# Altium schematic sheet MCU_watch.SchDoc: MCU_Watch
size A4; Author: Sajitha Madugalle; Revision: 1; SheetNumber: 5; SheetTotal: 8
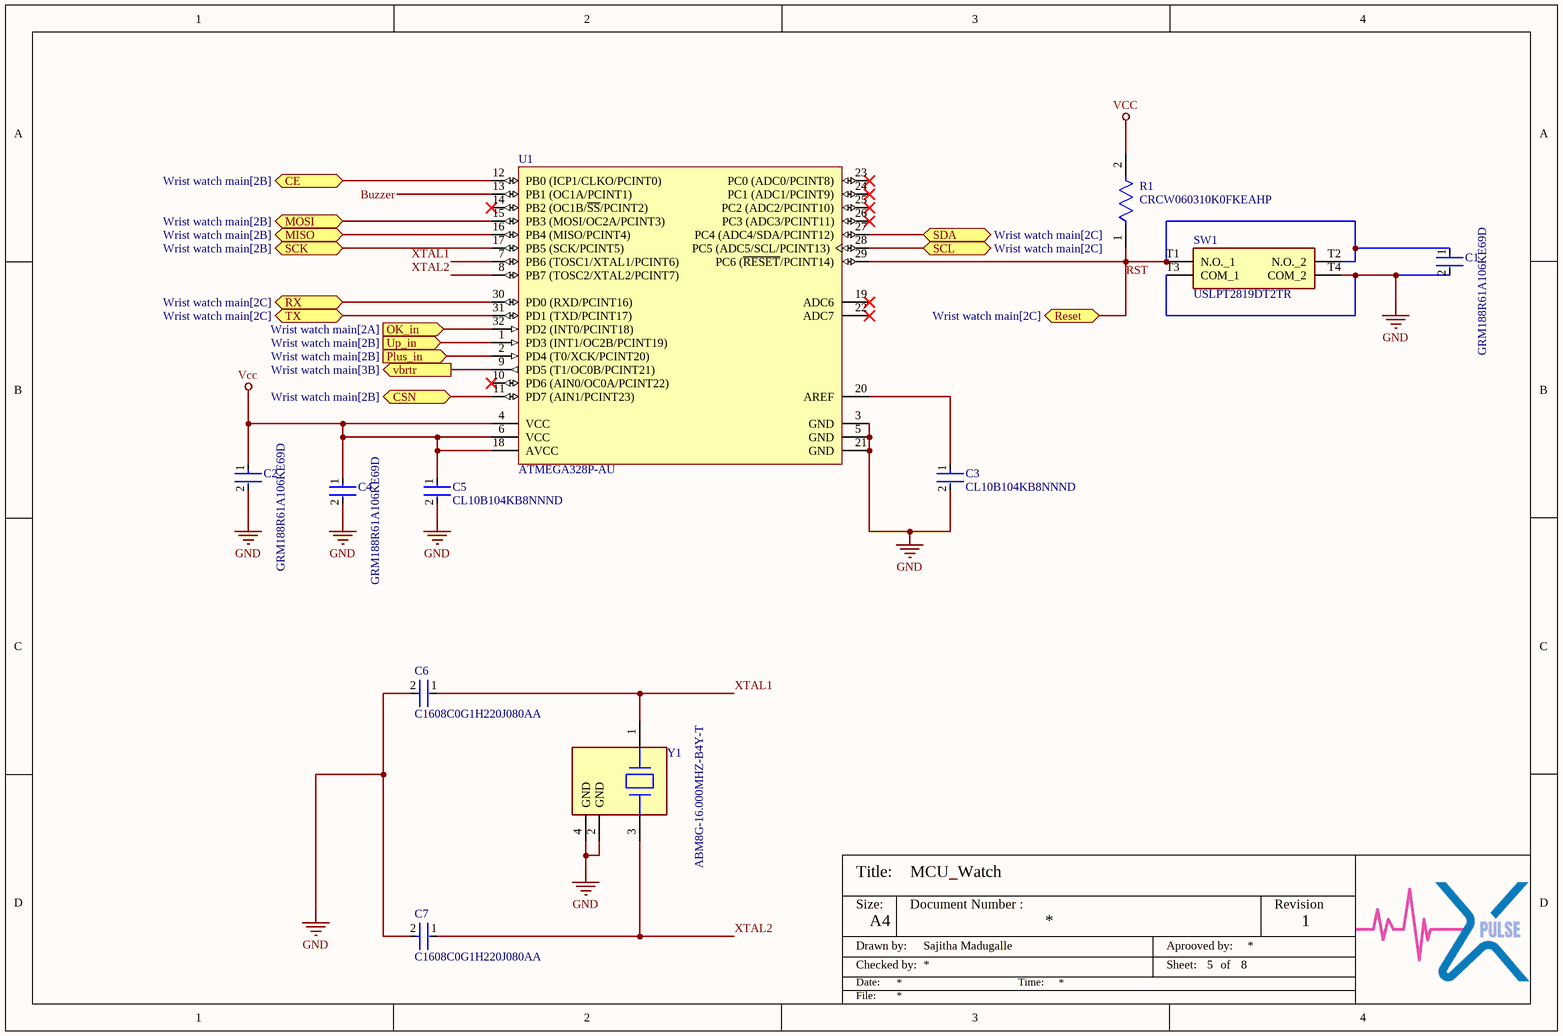
[diagram p0: MCU_watch.SchDoc]

## Parts
C1  GRM188R61A106KE69D  [FP-GRM18-0_15-MFG]
C2  GRM188R61A106KE69D  [FP-GRM18-0_15-MFG]
C3  CL10B104KB8NNND  [FP-CL10-IPC_A]
C4  GRM188R61A106KE69D  [FP-GRM18-0_15-MFG]
C5  CL10B104KB8NNND  [FP-CL10-IPC_A]
C6  C1608C0G1H220J080AA  [FP-C1608-080-0_1-IPC_B]
C7  C1608C0G1H220J080AA  [FP-C1608-080-0_1-IPC_B]
R1  CRCW060310K0FKEAHP  [FP-CRCW0603-HPe3-MFG]
SW1  USLPT2819DT2TR  [USLPT2819DT2TR]
U1  ATMEGA328P-AU  [ATML-32A_M]
Y1  ABM8G-16.000MHZ-B4Y-T  [FP-ABM8G-MFG]

## Ports
CE (bidir, see Wrist watch main[2B]), CSN (bidir, see Wrist watch main[2B]), MISO (bidir, see Wrist watch main[2B]), MOSI (bidir, see Wrist watch main[2B]), OK_in (in, see Wrist watch main[2A]), Plus_in (in, see Wrist watch main[2B]), Reset (bidir, see Wrist watch main[2C]), RX (bidir, see Wrist watch main[2C]), SCK (bidir, see Wrist watch main[2B]), SCL (bidir, see Wrist watch main[2C]), SDA (bidir, see Wrist watch main[2C]), TX (bidir, see Wrist watch main[2C]), Up_in (in, see Wrist watch main[2B]), vbrtr (out, see Wrist watch main[3B])

## Nets
GND: C1.2 C2.2 C3.2 C4.2 C5.2 C6.2 C7.2 SW1.T3(COM_1) SW1.T4(COM_2) U1.3(GND) U1.5(GND) U1.21(GND) Y1.2(GND) Y1.4(GND)
Vcc: C2.1 C4.1 C5.1 R1.2 U1.4(VCC) U1.6(VCC) U1.18(AVCC)
Buzzer: U1.13(PB1_(OC1A/PCINT1))
CE: U1.12(PB0_(ICP1/CLKO/PCINT0)) ; port CE
CSN: U1.11(PD7_(AIN1/PCINT23)) ; port CSN
MISO: U1.16(PB4_(MISO/PCINT4)) ; port MISO
MOSI: U1.15(PB3_(MOSI/OC2A/PCINT3)) ; port MOSI
OK_in: U1.32(PD2_(INT0/PCINT18)) ; port OK_in
Plus_in: U1.2(PD4_(T0/XCK/PCINT20)) ; port Plus_in
RST: C1.1 R1.1 SW1.T1(N.O._1) SW1.T2(N.O._2) U1.29(PC6_(~{RESET}/PCINT14)) ; port Reset
RX: U1.30(PD0_(RXD/PCINT16)) ; port RX
SCK: U1.17(PB5_(SCK/PCINT5)) ; port SCK
SCL: U1.28(PC5_(ADC5/SCL/PCINT13)) ; port SCL
SDA: U1.27(PC4_(ADC4/SDA/PCINT12)) ; port SDA
TX: U1.31(PD1_(TXD/PCINT17)) ; port TX
Up_in: U1.1(PD3_(INT1/OC2B/PCINT19)) ; port Up_in
vbrtr: U1.9(PD5_(T1/OC0B/PCINT21)) ; port vbrtr
XTAL1: C6.1 U1.7(PB6_(TOSC1/XTAL1/PCINT6)) Y1.1
XTAL2: C7.1 U1.8(PB7_(TOSC2/XTAL2/PCINT7)) Y1.3
NetC3_1: C3.1 U1.20(AREF)

Not connected (* = marked no-connect by the designer): U1 10(PD6_(AIN0/OC0A/PCINT22))* 14(PB2_(OC1B/~{SS}/PCINT2))* 19(ADC6)* 22(ADC7)* 23(PC0_(ADC0/PCINT8))* 24(PC1_(ADC1/PCINT9))* 25(PC2_(ADC2/PCINT10))* 26(PC3_(ADC3/PCINT11))*

## Notes on the sheet
- Title:
- Size:
- Document Number :
- Revision
- Drawn by:
- Checked by:
- Date:
- A4
- Time:
- Aprooved by:
- Sheet:
- of
- File:

## Library data of the parts
C1 C2 C4 = CMP-2000-05448-2: CAP CER 10UF 10V X5R 0603; Manufacturer: Murata; Temperature Coefficient: 15%; Material: Ceramic; Tolerance: 10%; Device Class L1: Passive Components; ComponentLink2Description: Datasheet; Height: 0.95mm; Package: GRM18-0.15; Octopart: https://octopart.com/grm188r61a106ke69d-murata-22851381; Manufacturer Part Number: GRM188R61A106KE69D; Value: 10uF; Digikey Description: CAP CER 10UF 10V X5R 0603; Temperature Range High: +85°C; Temperature Range Low: -55°C; Temperature Characteristic: X5R; Capacitance: 10uF; RoHS: TRUE; Device Class L2: Capacitors; ComponentLink2URL: https://search.murata.co.jp/Ceramy/image/img/A01X/G101/ENG/GRM188R61A106KE69-01A.pdf; Device Class L3: Ceramic Capacitors; Lead Free: Yes; Mouser Description: Multilayer Ceramic Capacitors MLCC - SMD/SMT 0603 10uF 10volts X5R + - 10%; Category: Cap; Voltage Rating: 10V; Temperature: -55°C to +85°C; Automotive: No
C3 C5 = CMP-13271-000587-1: Cap Ceramic 100nF 50V X7R ±10% Pad SMD 0603 +125°C T/R; Case/Package: 0603; Depth: 0.8mm; Max Operating Temperature: 125°C; Lead Free: Lead Free; Material: Ceramic; Voltage Rating: 50V; Min Operating Temperature: -55°C; Voltage Rating (DC): 50V; Dielectric: X7R; Height: 0.8mm; Capacitance: 100nF; Thickness: 0.035inch; Radiation Hardening: No; Voltage: 50V; Packaging: Tape and Reel; Length: 1.6mm; Tolerance: 10%; Width: 0.031inch; Mount: Surface Mount; Package Quantity: 10000
C6 C7 = CMP-2000-06024-2: CAP CER 22PF 50V C0G 0603; Tolerance: 5%; Temperature Coefficient: 30ppm/°C; Dielectric Material: Ceramic; Packaging: Tape and Reel; Termination: SMD/SMT; Case Code (Imperial): 0603; Height: 0.8mm; Capacitance: 22pF; Voltage: 50V; RoHS Compliant: Yes; Voltage Rating: 50V; Depth: 0.8mm; Case Code (Metric): 1608; Voltage Rating (DC): 50V; Construction: Flat; Max Operating Temperature: 125°C; Radiation Hardening: No; Lead Free: Lead Free; Number of Pins: 2; Case/Package: 0603; Thickness: 0.037inch; Min Operating Temperature: -55°C; Width: 0.031inch; Mount: Surface Mount; Weight: 7.1E-05oz; Series: C; Dielectric: C0G; Package Quantity: 1; Length: 1.6mm
R1 = CMP-2000-03835-2: RES SMD 10K OHM 1% 1/3W 0603; Resistance: 10kR; Voltage Rating (DC): 75V; Max Power Dissipation: 250mW; Temperature Coefficient: 100ppm/°C; Case Code (Metric): 1608; Features: Automotive AEC-Q200; Termination: SMD/SMT; Number of Terminations: 2; Case Code (Imperial): 0603; Tolerance: 1%; Depth: 0.85mm; Package Quantity: 10; Length: 1.6mm; Packaging: Tape and Reel; Contact Plating: Tin; Radiation Hardening: No; Case/Package: 0603; Composition: Thick Film; Voltage Rating: 75V; Weight: 7.1E-05oz; Max Operating Temperature: 155°C; Lead Free: Lead Free; Width: 0.033inch; Power Rating: 250mW; Min Operating Temperature: -55°C; Military Standard: Not; Height: 0.45mm
SW1 = USLPT2819DT2TR: Switch; Manufacturer_Name: TE Connectivity; Datasheet Link: https://www.te.com/commerce/DocumentDelivery/DDEController?Action=srchrtrv&DocNm=2337225-1&DocType=Data%20Sheet&DocLang=English&PartCntxt=2337225-1&DocFormat=pdf; Height: 0.6mm; Manufacturer_Part_Number: USLPT2819DT2TR; Mouser Part Number: 506-USLPT2819DT2TR; Mouser Price/Stock: https://www.mouser.co.uk/ProductDetail/TE-Connectivity-PB/USLPT2819DT2TR?qs=qSfuJ%252Bfl%2Fd7zUoyEnK5Yzg%3D%3D; Arrow Part Number: USLPT2819DT2TR; Arrow Price/Stock: https://www.arrow.com/en/products/uslpt2819dt2tr/te-connectivity?region=nac
U1 = CMP-020-00003-3: 8-Bit Microcontroller with 32 KBytes In-System Programmable Flash, 23 I/Os, -40 to 85 degC, 32-Pin TQFP (32A), RoHS, Tray; Manufacturer: Atmel; PWM Channels: 6; Frequency: 20MHz; RAM Size: 2KB; ADC Channels: 8; Max Supply Voltage: 5.5V; Density: 32KB; USB Channels: 0; I/Os: 23; Min Supply Voltage: 1.8V; Interface: USART; Package Reference: 32A; Package Description: 32-Pin Thin Profile Plastic Quad Flat Package, Body 7 x 7 mm, Pitch 0.8 mm; Max Operating Temperature: 85°C; Mounting Technology: SM; Datasheet URL: http://www.atmel.com/images/Atmel-8271-8-bit-AVR-Microcontroller-ATmega48A-48PA-88A-88PA-168A-168PA-328-328P_datasheet_Complete.pdf; Pins: 32; Packaging: Tray; RoHS Compliant: True; Max Clock Frequency: 20MHz; Ethernet Channels: 0; Clock Frequency: 20MHz; Case/Package: TQFP; Manufacturer URL: http://www.atmel.com/; Datasheet Version: Rev. 8271J, 11/2015; Package Quantity: 250; Min Operating Temperature: -40°C
Y1 = CMP-27762-015167-1: Crystal 16MHz ±30ppm (Tol) ±30ppm (Stability) 10pF FUND 80Ω 4-Pin SMD T/R; ESR (Equivalent Series Resistance): 80R; Package Quantity: 1000; Frequency: 16MHz; Length: 3.2mm; Tolerance: 30ppm; Frequency Stability: 30ppm; Depth: 2.5mm; Termination: SMD/SMT; Number of Pins: 4; Max Operating Temperature: 70°C; Min Operating Temperature: -20°C; Mount: Surface Mount; Lead Free: Lead Free; Frequency Tolerance: 30ppm; Width: 2.5mm; Series: ABM8G; Load Capacitance: 10pF; Operating Frequency: 16 MHz; Case/Package: CSMD; Height: 1mm; Packaging: Tape and Reel